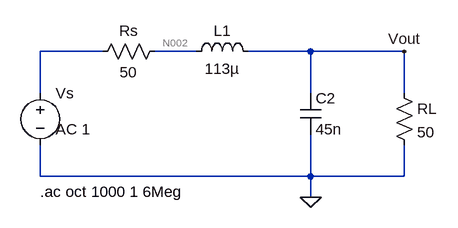
[diagram p0: schematic ButterworthLowPass.asc]
ButterworthLowPass.asc, the LTspice schematic file:
Version 4
SHEET 1 880 680
WIRE 176 48 80 48
WIRE 320 48 256 48
WIRE 496 48 400 48
WIRE 640 48 496 48
WIRE 80 112 80 48
WIRE 496 112 496 48
WIRE 640 112 640 48
WIRE 80 240 80 192
WIRE 496 240 496 176
WIRE 496 240 80 240
WIRE 640 240 640 192
WIRE 640 240 496 240
WIRE 496 272 496 240
FLAG 496 272 0
FLAG 640 48 Vout
SYMBOL voltage 80 96 R0
WINDOW 3 24 44 Left 2
WINDOW 123 24 72 Left 2
WINDOW 39 0 0 Left 2
SYMATTR InstName Vs
SYMATTR Value ""
SYMATTR Value2 AC 1
SYMBOL res 272 32 R90
WINDOW 0 0 56 VBottom 2
WINDOW 3 32 56 VTop 2
SYMATTR InstName Rs
SYMATTR Value 50
SYMBOL res 624 96 R0
SYMATTR InstName RL
SYMATTR Value 50
SYMBOL ind 304 64 R270
WINDOW 0 32 56 VTop 2
WINDOW 3 5 56 VBottom 2
SYMATTR InstName L1
SYMATTR Value 113µ
SYMBOL cap 480 112 R0
SYMATTR InstName C2
SYMATTR Value 45n
TEXT 80 264 Left 2 !.ac oct 1000 1 6Meg

The netlist it stands for:
* ButterworthLowPass.asc
Vs N001 0 AC 1
Rs N002 N001 50
RL Vout 0 50
L1 N002 Vout 113µ
C2 Vout 0 45n
.ac oct 1000 1 6Meg
.backanno
.end

* Results of the author's LTspice run, read from the files saved beside the schematic
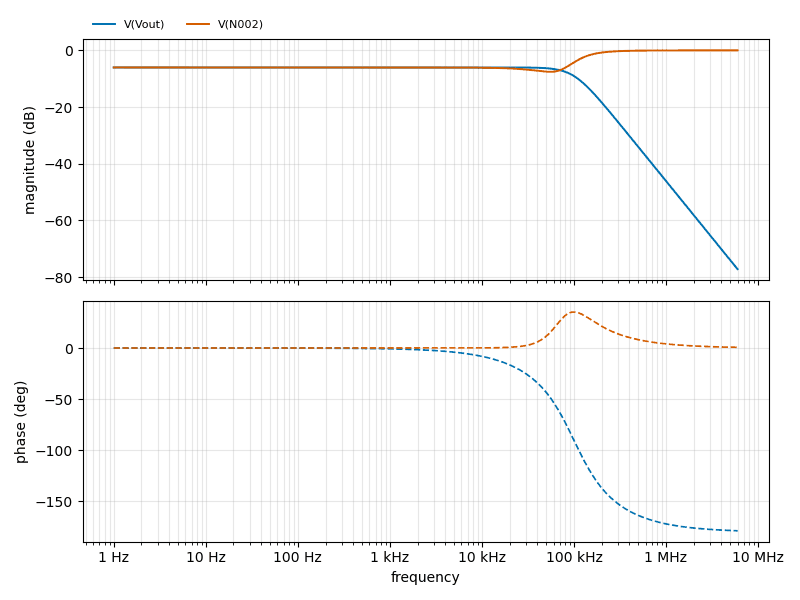
[diagram p1: AC Analysis of ButterworthLowPass.asc, plotted from the saved traces]
* AC Analysis, 1 run:
*   V(Vout): -6.02 dB at 1 Hz, -77.18 dB at 6 MHz, peak -6.02 dB at 1.05 Hz, 3 dB below the peak at 99.81 kHz
*   V(N002): -6.02 dB at 1 Hz, -0.00 dB at 6 MHz, peak -0.00 dB at 6 MHz, 3 dB below the peak at 116.5 kHz